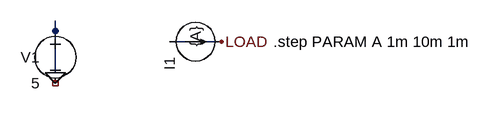
[diagram p0: schematic case_08.asc]
case_08.asc, the LTspice schematic file:
Version 4.1
SHEET 1 880 680
WIRE 128 192 128 272
WIRE 304 224 384 224
FLAG 128 272 0
FLAG 384 224 LOAD
SYMBOL Sources\voltage 128 192 M0
WINDOW 0 24 56 Left 2
SYMATTR InstName V1
SYMATTR SpiceLine Rser=0.01
SYMATTR Value 5
SYMBOL current 304 224 M90
WINDOW 3 -24 40 Left 2
SYMATTR InstName I1
SYMATTR Type current
SYMATTR Value {A}
TEXT 464 224 Left 2 !.step PARAM A 1m 10m 1m

The netlist it stands for:
* case_08.asc
V1 0 NC_01 5 Rser=0.01
I1 LOAD LOAD {A}
.step PARAM A 1m 10m 1m
.backanno
.end